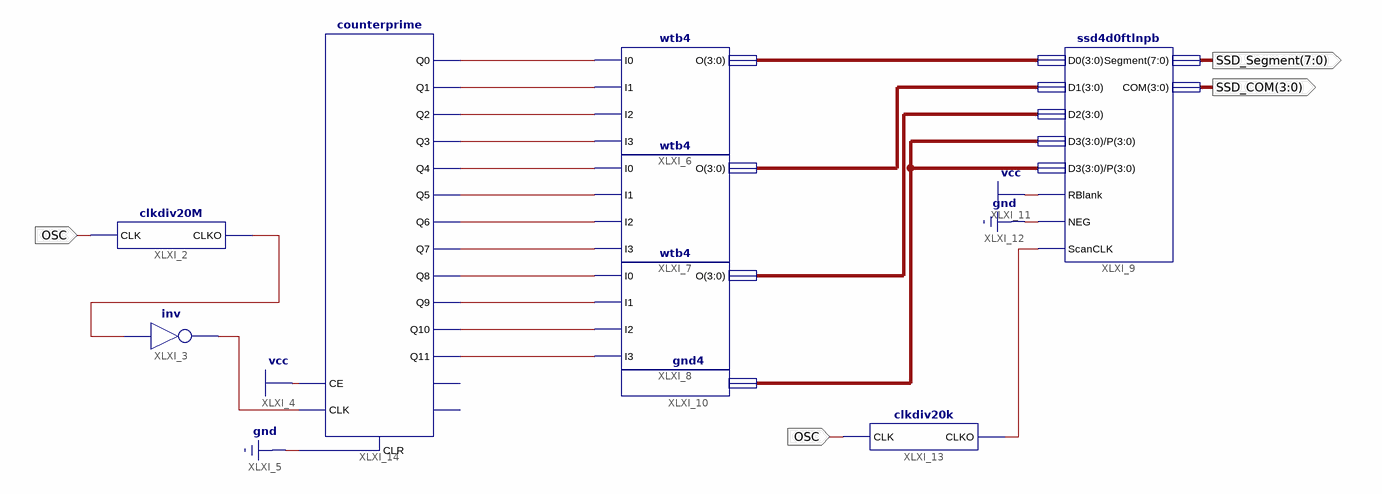
[diagram p0: schematic sheet 1]
// Xilinx ISE schematic main.sch (spartan6) as structural Verilog: 9 symbols, 3 ports
module main (
  input  OSC,
  output [3:0] SSD_COM,
  output [7:0] SSD_Segment
);

  wire XLXN_1, XLXN_2, XLXN_6, XLXN_7, XLXN_8, XLXN_9, XLXN_10, XLXN_11, XLXN_12, XLXN_13, XLXN_14, XLXN_15,
       XLXN_16, XLXN_17, XLXN_25;
  wire [3:0] XLXN_18, XLXN_19, XLXN_20, XLXN_21;

  clkdiv20M XLXI_2 (.CLK(OSC), .CLKO(XLXN_1));
  not XLXI_3 (XLXN_2, XLXN_1);
  wtb4 XLXI_6 (.I0(XLXN_6), .I1(XLXN_7), .I2(XLXN_8), .I3(XLXN_9), .O(XLXN_18));
  wtb4 XLXI_7 (.I0(XLXN_10), .I1(XLXN_11), .I2(XLXN_12), .I3(XLXN_13), .O(XLXN_19));
  wtb4 XLXI_8 (.I0(XLXN_14), .I1(XLXN_15), .I2(XLXN_16), .I3(XLXN_17), .O(XLXN_20));
  ssd4d0ftlnpb XLXI_9 (
    .COM(SSD_COM), .D0(XLXN_18), .D1(XLXN_19), .D2(XLXN_20), .D3(XLXN_21), .NEG(1'b0), .P(XLXN_21),
    .RBlank(1'b1), .ScanCLK(XLXN_25), .Segment(SSD_Segment));
  gnd4 XLXI_10 (.GND(XLXN_21));
  clkdiv20k XLXI_13 (.CLK(OSC), .CLKO(XLXN_25));
  counterprime XLXI_14 (
    .CE(1'b1), .CLK(XLXN_2), .CLR(1'b0), .Q0(XLXN_6), .Q1(XLXN_7), .Q10(XLXN_16), .Q11(XLXN_17), .Q2(XLXN_8),
    .Q3(XLXN_9), .Q4(XLXN_10), .Q5(XLXN_11), .Q6(XLXN_12), .Q7(XLXN_13), .Q8(XLXN_14), .Q9(XLXN_15));  // open: CEO, TC
endmodule
